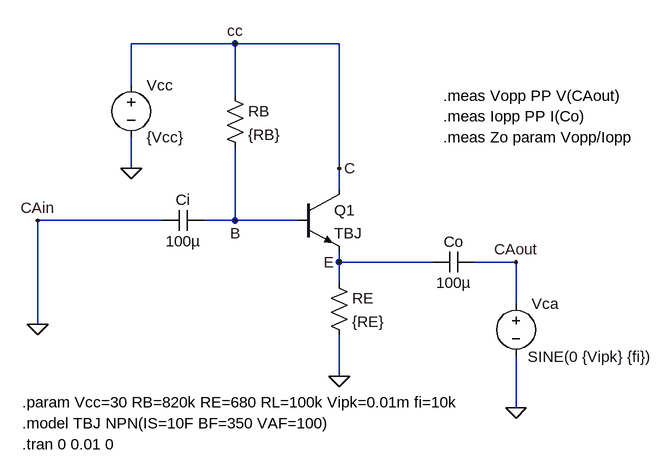
[diagram p0: schematic TBJ03CAZo.asc]
TBJ03CAZo.asc, the LTspice schematic file:
Version 4
SHEET 1 1608 1200
WIRE 128 -16 -32 -16
WIRE 288 -16 128 -16
WIRE -32 48 -32 -16
WIRE 128 64 128 -16
WIRE -32 176 -32 128
WIRE 288 176 288 -16
WIRE 288 208 288 176
WIRE 16 256 -176 256
WIRE 128 256 128 144
WIRE 128 256 80 256
WIRE 224 256 128 256
WIRE 288 320 288 304
WIRE 432 320 288 320
WIRE 560 320 496 320
WIRE 288 352 288 320
WIRE 560 384 560 320
WIRE -176 416 -176 256
WIRE 288 496 288 432
WIRE 560 544 560 464
FLAG -32 176 0
FLAG 288 496 0
FLAG -176 416 0
FLAG 128 -16 cc
FLAG -176 256 CAin
FLAG 560 544 0
FLAG 560 320 CAout
FLAG 128 256 B
FLAG 288 176 C
FLAG 288 320 E
SYMBOL res 112 48 R0
SYMATTR InstName RB
SYMATTR Value {RB}
SYMBOL voltage -32 32 R0
WINDOW 123 0 0 Left 0
WINDOW 39 0 0 Left 0
SYMATTR InstName Vcc
SYMATTR Value {Vcc}
SYMBOL npn 224 208 R0
SYMATTR InstName Q1
SYMATTR Value TBJ
SYMBOL cap 80 240 R90
WINDOW 0 0 32 VBottom 2
WINDOW 3 32 32 VTop 2
SYMATTR InstName Ci
SYMATTR Value 100µ
SYMBOL cap 496 304 R90
WINDOW 0 0 32 VBottom 2
WINDOW 3 32 32 VTop 2
SYMATTR InstName Co
SYMATTR Value 100µ
SYMBOL voltage 560 368 R0
WINDOW 123 0 0 Left 0
WINDOW 39 0 0 Left 0
WINDOW 3 18 98 Left 2
SYMATTR Value SINE(0 {Vipk} {fi})
SYMATTR InstName Vca
SYMBOL res 272 336 R0
SYMATTR InstName RE
SYMATTR Value {RE}
TEXT -200 536 Left 2 !.param Vcc=30 RB=820k RE=680 RL=100k Vipk=0.01m fi=10k
TEXT -200 568 Left 2 !.model TBJ NPN(IS=10F BF=350 VAF=100)
TEXT -200 600 Left 2 !.tran 0 0.01 0
TEXT 448 64 Left 2 !.meas Vopp PP V(CAout)
TEXT 448 96 Left 2 !.meas Iopp PP I(Co)
TEXT 448 128 Left 2 !.meas Zo param Vopp/Iopp

The netlist it stands for:
* TBJ03CAZo.asc
RB C B {RB}
Vcc C 0 {Vcc}
Q1 C B E 0 TBJ
Ci B 0 100µ
Co CAout E 100µ
Vca CAout 0 SINE(0 {Vipk} {fi})
RE E 0 {RE}
.model NPN NPN
.model PNP PNP
.lib standard.bjt
.param Vcc=30 RB=820k RE=680 RL=100k Vipk=0.01m fi=10k
.model TBJ NPN(IS=10F BF=350 VAF=100)
.tran 0 0.01 0
.meas Vopp PP V(CAout)
.meas Iopp PP I(Co)
.meas Zo param Vopp/Iopp
.backanno
.end